# Altium schematic sheet SHDN-S06-V00-Microcontroller.SchDoc: Microcontroller
size A3; DrawnBy: Jonn DIllon; DocumentNumber: 5; Revision: 01; SheetNumber: 5; SheetTotal: 11; Version: 01; Project: Shutdown Board 2020; PageSetup: Record=PageOptions|CenterHorizontal=True|CenterVertical=True|PrintScale=0.97|XCorrection=1.00|YCorrection=1.00|PrintKind=0|BorderSize=5000000|LeftOffset=0|BottomOffset=0|Orientation=2|PaperLength=1000|PaperWidth=1000|Scale=100|PaperSource=7|PrintQuality=-4|MediaType=1|DitherType=10|PaperKind=A4|PrintScaleMode=1
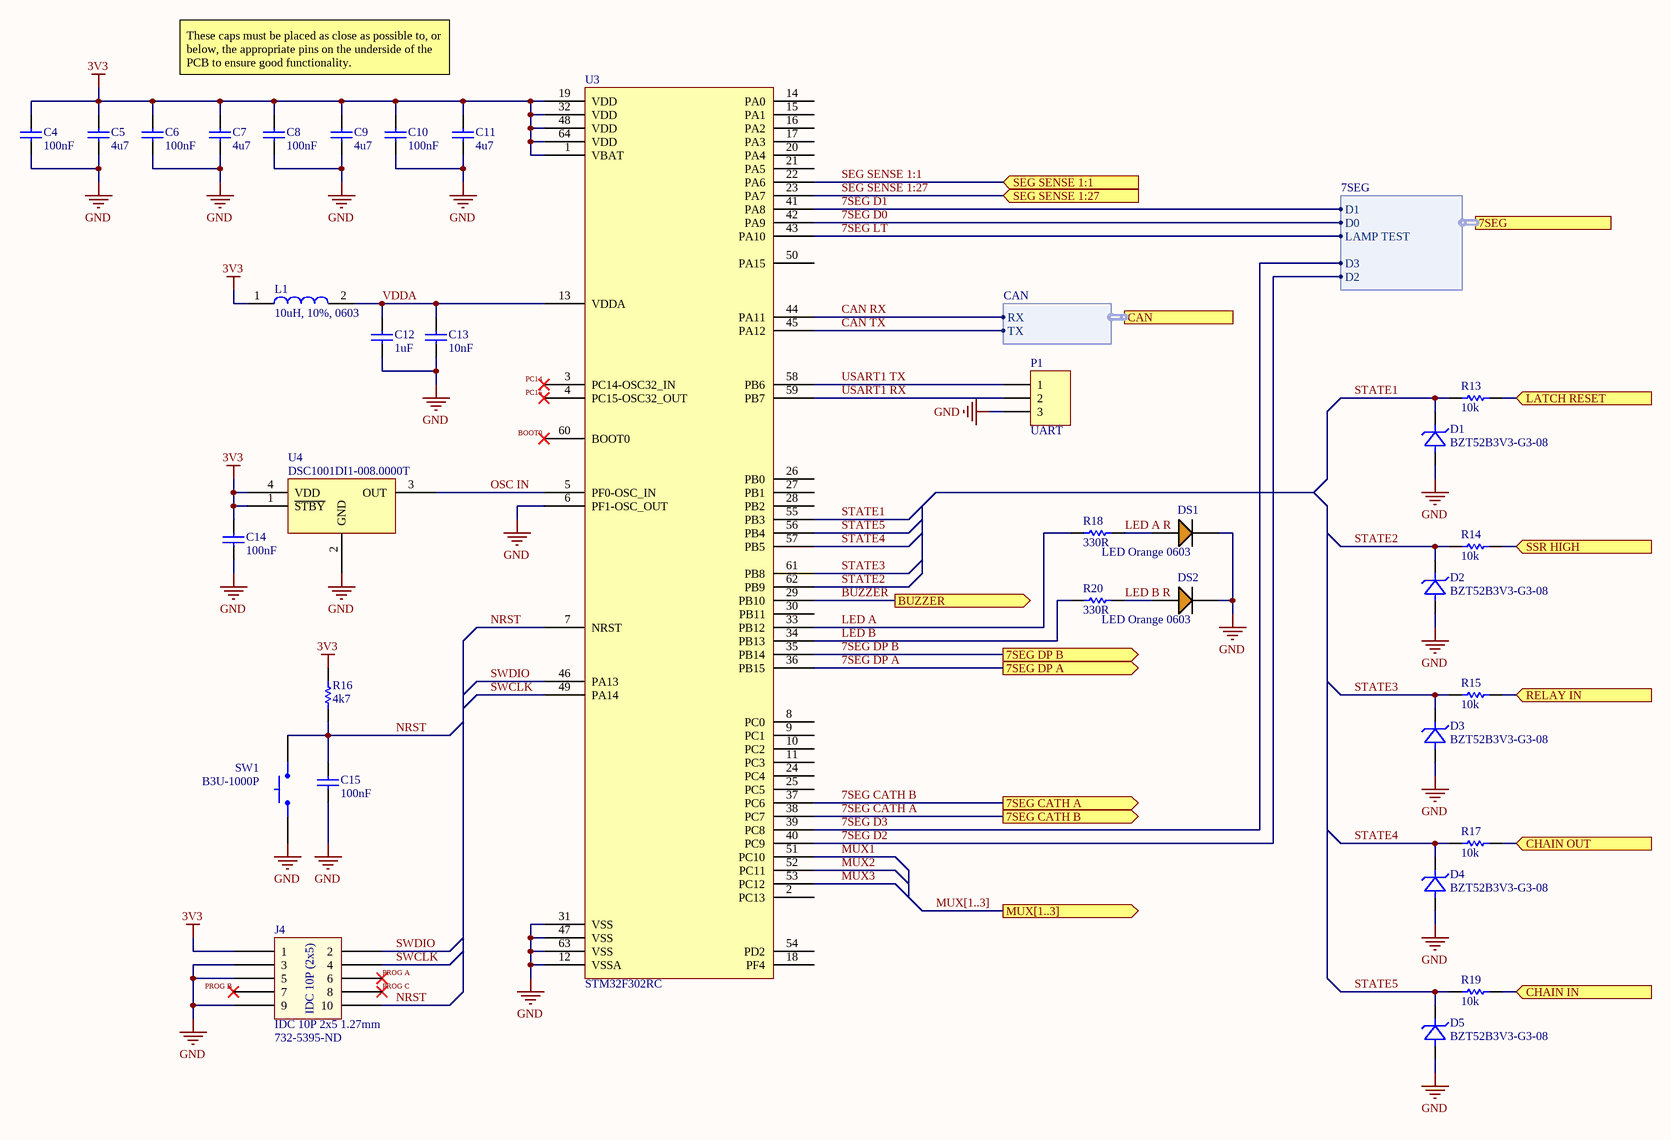
[diagram p0: SHDN-S06-V00-Microcontroller.SchDoc]

## Parts
C4  100nF  [Cap_Ceramic_0603]
C5  4u7  [Cap_Ceramic_0603]
C6  100nF  [Cap_Ceramic_0603]
C7  4u7  [Cap_Ceramic_0603]
C8  100nF  [Cap_Ceramic_0603]
C9  4u7  [Cap_Ceramic_0603]
C10  100nF  [Cap_Ceramic_0603]
C11  4u7  [Cap_Ceramic_0603]
C12  1uF  [Cap_Ceramic_0603]
C13  10nF  [Cap_Ceramic_0603]
C14  100nF  [Cap_Ceramic_0603]
C15  100nF  [Cap_Ceramic_0603]
D1  BZT52B3V3-G3-08  [SOD123]
D2  BZT52B3V3-G3-08  [SOD123]
D3  BZT52B3V3-G3-08  [SOD123]
D4  BZT52B3V3-G3-08  [SOD123]
D5  BZT52B3V3-G3-08  [SOD123]
DS1  LED Orange 0603  [LED ORANGE 0603]
DS2  LED Orange 0603  [LED ORANGE 0603]
J4  IDC 10P 2x5 1.27mm  [IDC 1.27MM 10P]
L1  10uH, 10%, 0603  [Inductor_0603]
P1  UART  [HDR1X3]
R13  10k  [Res_ThinFilm_0603]
R14  10k  [Res_ThinFilm_0603]
R15  10k  [Res_ThinFilm_0603]
R16  4k7  [Res_ThinFilm_0603]
R17  10k  [Res_ThinFilm_0603]
R18  330R  [Res_ThinFilm_0603]
R19  10k  [Res_ThinFilm_0603]
R20  330R  [Res_ThinFilm_0603]
SW1  B3U-1000P  [BTN B3U-1000P]
U3  STM32F302RC  [STM32F302RC]
U4  DSC1001DI1-008.0000T  [DSC1001DI1-008.0000TCT-ND]

## Ports
7SEG (harness 7SEG), 7SEG CATH A (out), 7SEG CATH B (out), 7SEG DP A (out), 7SEG DP B (out), BUZZER (out), CAN (harness CAN), CHAIN IN (in), CHAIN OUT (in), LATCH RESET (in), MUX[1..3] (out), RELAY IN (in), SEG SENSE 1:1 (in), SEG SENSE 1:27 (in), SSR HIGH (in)

## Harnesses
CAN: RX, TX
7SEG: D3, D2, D1, D0, LAMP TEST

## Nets
3V3: C4.2 C5.2 C6.2 C7.2 C8.2 C9.2 C10.2 C11.2 C14.2 J4.1 L1.1 R16.2 U3.1(VBAT) U3.19(VDD) U3.32(VDD) U3.48(VDD) U3.64(VDD) U4.1(~{STBY}) U4.4(VDD)
GND: C4.1 C5.1 C6.1 C7.1 C8.1 C9.1 C10.1 C11.1 C12.1 C13.1 C14.1 C15.1 D1.A(Anode) D2.A(Anode) D3.A(Anode) D4.A(Anode) D5.A(Anode) DS1.2(C) DS2.2(C) J4.3 J4.5 J4.9 P1.3 SW1.1 U3.6(PF1-OSC_OUT) U3.12(VSSA) U3.31(VSS) U3.47(VSS) U3.63(VSS) U4.2(GND)
7SEG CATH A: U3.38(PC7) ; port 7SEG CATH B
7SEG CATH B: U3.37(PC6) ; port 7SEG CATH A
7SEG D0: U3.42(PA9) ; port 7SEG.D0
7SEG D1: U3.41(PA8) ; port 7SEG.D1
7SEG D2: U3.40(PC9) ; port 7SEG.D2
7SEG D3: U3.39(PC8) ; port 7SEG.D3
7SEG DP A: U3.36(PB15) ; port 7SEG DP A
7SEG DP B: U3.35(PB14) ; port 7SEG DP B
7SEG LT: U3.43(PA10) ; port 7SEG.LAMP TEST
BOOT0: U3.60(BOOT0)
BUZZER: U3.29(PB10) ; port BUZZER
CAN RX: U3.44(PA11) ; port CAN.RX
CAN TX: U3.45(PA12) ; port CAN.TX
CHAIN IN: R19.2 ; port CHAIN IN
CHAIN OUT: R17.2 ; port CHAIN OUT
LATCH RESET: R13.2 ; port LATCH RESET
LED A: R18.1 U3.33(PB12)
LED A R: DS1.1(A) R18.2
LED B: R20.1 U3.34(PB13)
LED B R: DS2.1(A) R20.2
MUX1: U3.51(PC10)
MUX2: U3.52(PC11)
MUX3: U3.53(PC12)
NRST: C15.2 J4.10 R16.1 SW1.2 U3.7(NRST)
OSC IN: U3.5(PF0-OSC_IN) U4.3(OUT)
PC14: U3.3(PC14-OSC32_IN)
PC15: U3.4(PC15-OSC32_OUT)
PROG A: J4.6
PROG B: J4.7
PROG C: J4.8
RELAY IN: R15.2 ; port RELAY IN
SEG SENSE 1:1: U3.22(PA6) ; port SEG SENSE 1:1
SEG SENSE 1:27: U3.23(PA7) ; port SEG SENSE 1:27
SSR HIGH: R14.2 ; port SSR HIGH
STATE1: D1.K(Cathode) R13.1 U3.55(PB3)
STATE2: D2.K(Cathode) R14.1 U3.62(PB9)
STATE3: D3.K(Cathode) R15.1 U3.61(PB8)
STATE4: D4.K(Cathode) R17.1 U3.57(PB5)
STATE5: D5.K(Cathode) R19.1 U3.56(PB4)
SWCLK: J4.4 U3.49(PA14)
SWDIO: J4.2 U3.46(PA13)
USART1 RX: P1.2 U3.59(PB7)
USART1 TX: P1.1 U3.58(PB6)
VDDA: C12.2 C13.2 L1.2 U3.13(VDDA)

Not connected (* = marked no-connect by the designer): U3 2(PC13) 8(PC0) 9(PC1) 10(PC2) 11(PC3) 14(PA0) 15(PA1) 16(PA2) 17(PA3) 18(PF4) 20(PA4) 21(PA5) 24(PC4) 25(PC5) 26(PB0) 27(PB1) 28(PB2) 30(PB11) 50(PA15) 54(PD2)

## Buses and harness runs
bus MUX[1..3] = port MUX[1..3]

## Notes on the sheet
- These caps must be placed as close as possible to, or below, the appropriate pins on the underside of the PCB to ensure good functionality.
- (near J4) 732-5395-ND
- Revision History:
- Sheet Title:
- Rev
- Date
- Description
- Project:
- Size:
- Drawn By:
- A3
- Number:
- Revision:
- Sheet
- Version:
- of
- QUT Motorsport
- O-120, Gardens Point
- 2 George Street
- Brisbane, QLD 4000
- Australia
- Print Date:
- Print Time:
- File Name:
- (in symbol IDC 10P 2x5 1.27mm) IDC 10P (2x5)

## Library data of the parts
C4 C6 C8 C10 C14 C15 = 100nF 50V 5% X7R 0603: Capacitor, Ceramic, SMD, 100nF, 50V, 5%, X7R, 0603
C5 C7 C9 C11 = 4u7 50V 5% X7R 0603: Capacitor, Ceramic, SMD, 4u7, 50V, 5%, X7R, 0603
C12 = 1uF 25V 5% X7R 0603: Capacitor, Ceramic, SMD, 1uF, 25V, 5%, X7R, 0603
C13 = 10nF 50V 5% X7R 0603: Capacitor, Ceramic, SMD, 10nF, 50V, 5%, X7R, 0603
D1-D5 = BZT52B3V3-G3-08: Diode, SMD, Zenner, 3.3V, 2%, 410mW, SOD-123; ComponentLink1Description: Digikey; ComponentLink1URL: https://www.digikey.com.au/product-detail/en/vishay-semiconductor-diodes-division/BZT52B3V3-G3-08/BZT52B3V3-G3-08GICT-ND/8284035; ComponentLink2Description: Datasheet; ComponentLink2URL: https://www.vishay.com/docs/83340/bzt52g.pdf
P1 = Header 3: Header, 3-Pin; LatestRevisionDate: 17-Jul-2002; LatestRevisionNote: Re-released for DXP Platform.; Publisher: Altium Limited
R13-R15 R17 R19 = 10k 5% 0603: Resistor, SMD, 10k, 0.1W, 5%, 0603
R16 = 4k7 5% 0603: Resistor, SMD, 4k7, 0.1W, 5%, 0603
R18 R20 = 330R 5% 0603: Resistor, SMD, 330R, 0.1W, 5%, 0603
SW1 = BTN B3U-1000P: Omron B3U-1000P Ultra Miniture Switch; ComponentLink1Description: LCSC; ComponentLink1URL: https://lcsc.com/product-detail/Tactile-Switches_BRIGHT-TSA063G50-250_C294565.html
U3 = STM32F302RC: ARM® Cortex®-M4 STM32F3 Microcontroller IC 32-Bit 72MHz 256KB (256K x 8) FLASH 64-LQFP (10x10); ComponentLink1Description: Digikey; ComponentLink1URL: https://www.digikey.com.au/product-detail/en/stmicroelectronics/STM32F302RCT6TR/497-19000-1-ND/9974332; ComponentLink2Description: Datasheet; ComponentLink2URL: http://www.st.com/content/ccc/resource/technical/document/datasheet/67/73/21/b9/f2/b3/4d/f8/DM00094064.pdf/files/DM00094064.pdf/jcr:content/translations/en.DM00094064.pdf
U4 = DSC1001DI1-008.0000T: on 8MHz XO (Standard) CMOS Oscillator 1.8 ~ 3.3V Standby (Power Down) 4-SMD, No Lead
L1 = 10uH, 10%, 0603: ComponentLink1Description: Digikey; ComponentLink1URL: https://www.digikey.com.au/product-detail/en/w%C3%BCrth-elektronik/74404064221/732-7261-1-ND/5353241; ComponentLink2Description: LCSC A; ComponentLink2URL: https://lcsc.com/product-detail/Power-Inductors_Sunlord-SWPA6045S221MT_C91047.html; ComponentLink3Description: LCSC B; ComponentLink3URL: https://lcsc.com/product-detail/Power-Inductors_SXN-Shun-Xiang-Nuo-Elec-SMNR6045-221MT_C467145.html